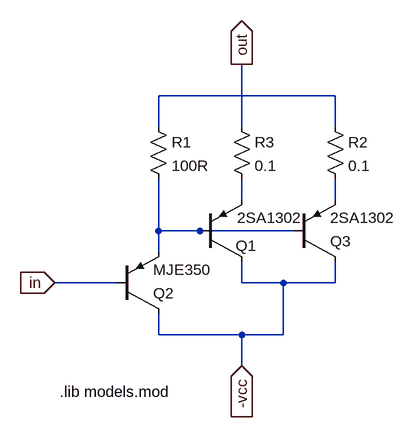
[diagram p0: schematic ss-trans-out-pnp.asc]
ss-trans-out-pnp.asc, the LTspice schematic file:
Version 4
SHEET 1 880 680
WIRE 64 -144 -208 -144
WIRE -208 -96 -208 -144
WIRE -80 -96 -80 -192
WIRE 64 -96 64 -144
WIRE -80 16 -80 -16
WIRE 64 16 64 -16
WIRE -208 64 -208 -16
WIRE -144 64 -208 64
WIRE 0 64 -144 64
WIRE -208 96 -208 64
WIRE -304 144 -368 144
WIRE -272 144 -304 144
WIRE -80 144 -80 112
WIRE -16 144 -80 144
WIRE 64 144 64 112
WIRE 64 144 -16 144
WIRE -208 224 -208 192
WIRE -80 224 -208 224
WIRE -16 224 -16 144
WIRE -16 224 -80 224
WIRE -80 272 -80 224
FLAG -80 272 -vcc
IOPIN -80 272 In
FLAG -80 -192 out
IOPIN -80 -192 Out
FLAG -368 144 in
IOPIN -368 144 In
DATAFLAG -304 144 "round($*100)/100"
SYMBOL pnp -144 112 M180
WINDOW 0 55 25 Left 2
WINDOW 3 57 68 Left 2
SYMATTR InstName Q1
SYMATTR Value 2SA1302
SYMBOL pnp -272 192 M180
SYMATTR InstName Q2
SYMATTR Value MJE350
SYMBOL pnp 0 112 M180
SYMATTR InstName Q3
SYMATTR Value 2SA1302
SYMBOL res -224 -112 R0
SYMATTR InstName R1
SYMATTR Value 100R
SYMBOL res 48 -112 R0
SYMATTR InstName R2
SYMATTR Value 0.1
SYMBOL res -96 -112 R0
SYMATTR InstName R3
SYMATTR Value 0.1
TEXT -360 312 Left 2 !.lib models.mod

The netlist it stands for:
* ss-trans-out-pnp.asc
Q1 -vcc N004 N002 0 2SA1302
Q2 -vcc in N004 0 MJE350
Q3 -vcc N004 N003 0 2SA1302
R1 N001 N004 100R
R2 N001 N003 0.1
R3 out N002 0.1
.model NPN NPN
.model PNP PNP
.lib standard.bjt
.lib models.mod
.backanno
.end